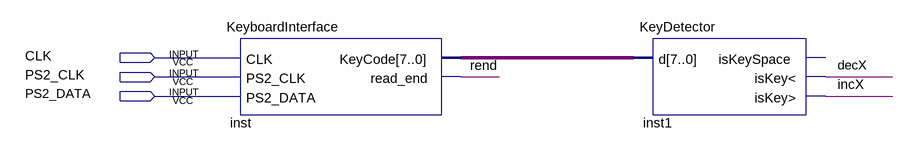
[diagram p0: schematic sheet]
// Quartus schematic ORTbrojanje.bdf as structural Verilog: 2 symbols, 3 pins
module ORTbrojanje (
  input  CLK,
  input  PS2_CLK,
  input  PS2_DATA
);

  wire decX, incX, rend;
  wire [7:0] inst_keycode;

  KeyboardInterface inst (.CLK(CLK), .PS2_CLK(PS2_CLK), .PS2_DATA(PS2_DATA), .KeyCode(inst_keycode), .read_end(rend));
  KeyDetector inst1 (.d(inst_keycode), .\isKey< (decX), .\isKey> (incX));  // open: isKeySpace
endmodule
